# Altium schematic sheet Schematic2_new.SchDoc
size A3; SheetNumber: 1; SheetTotal: 1
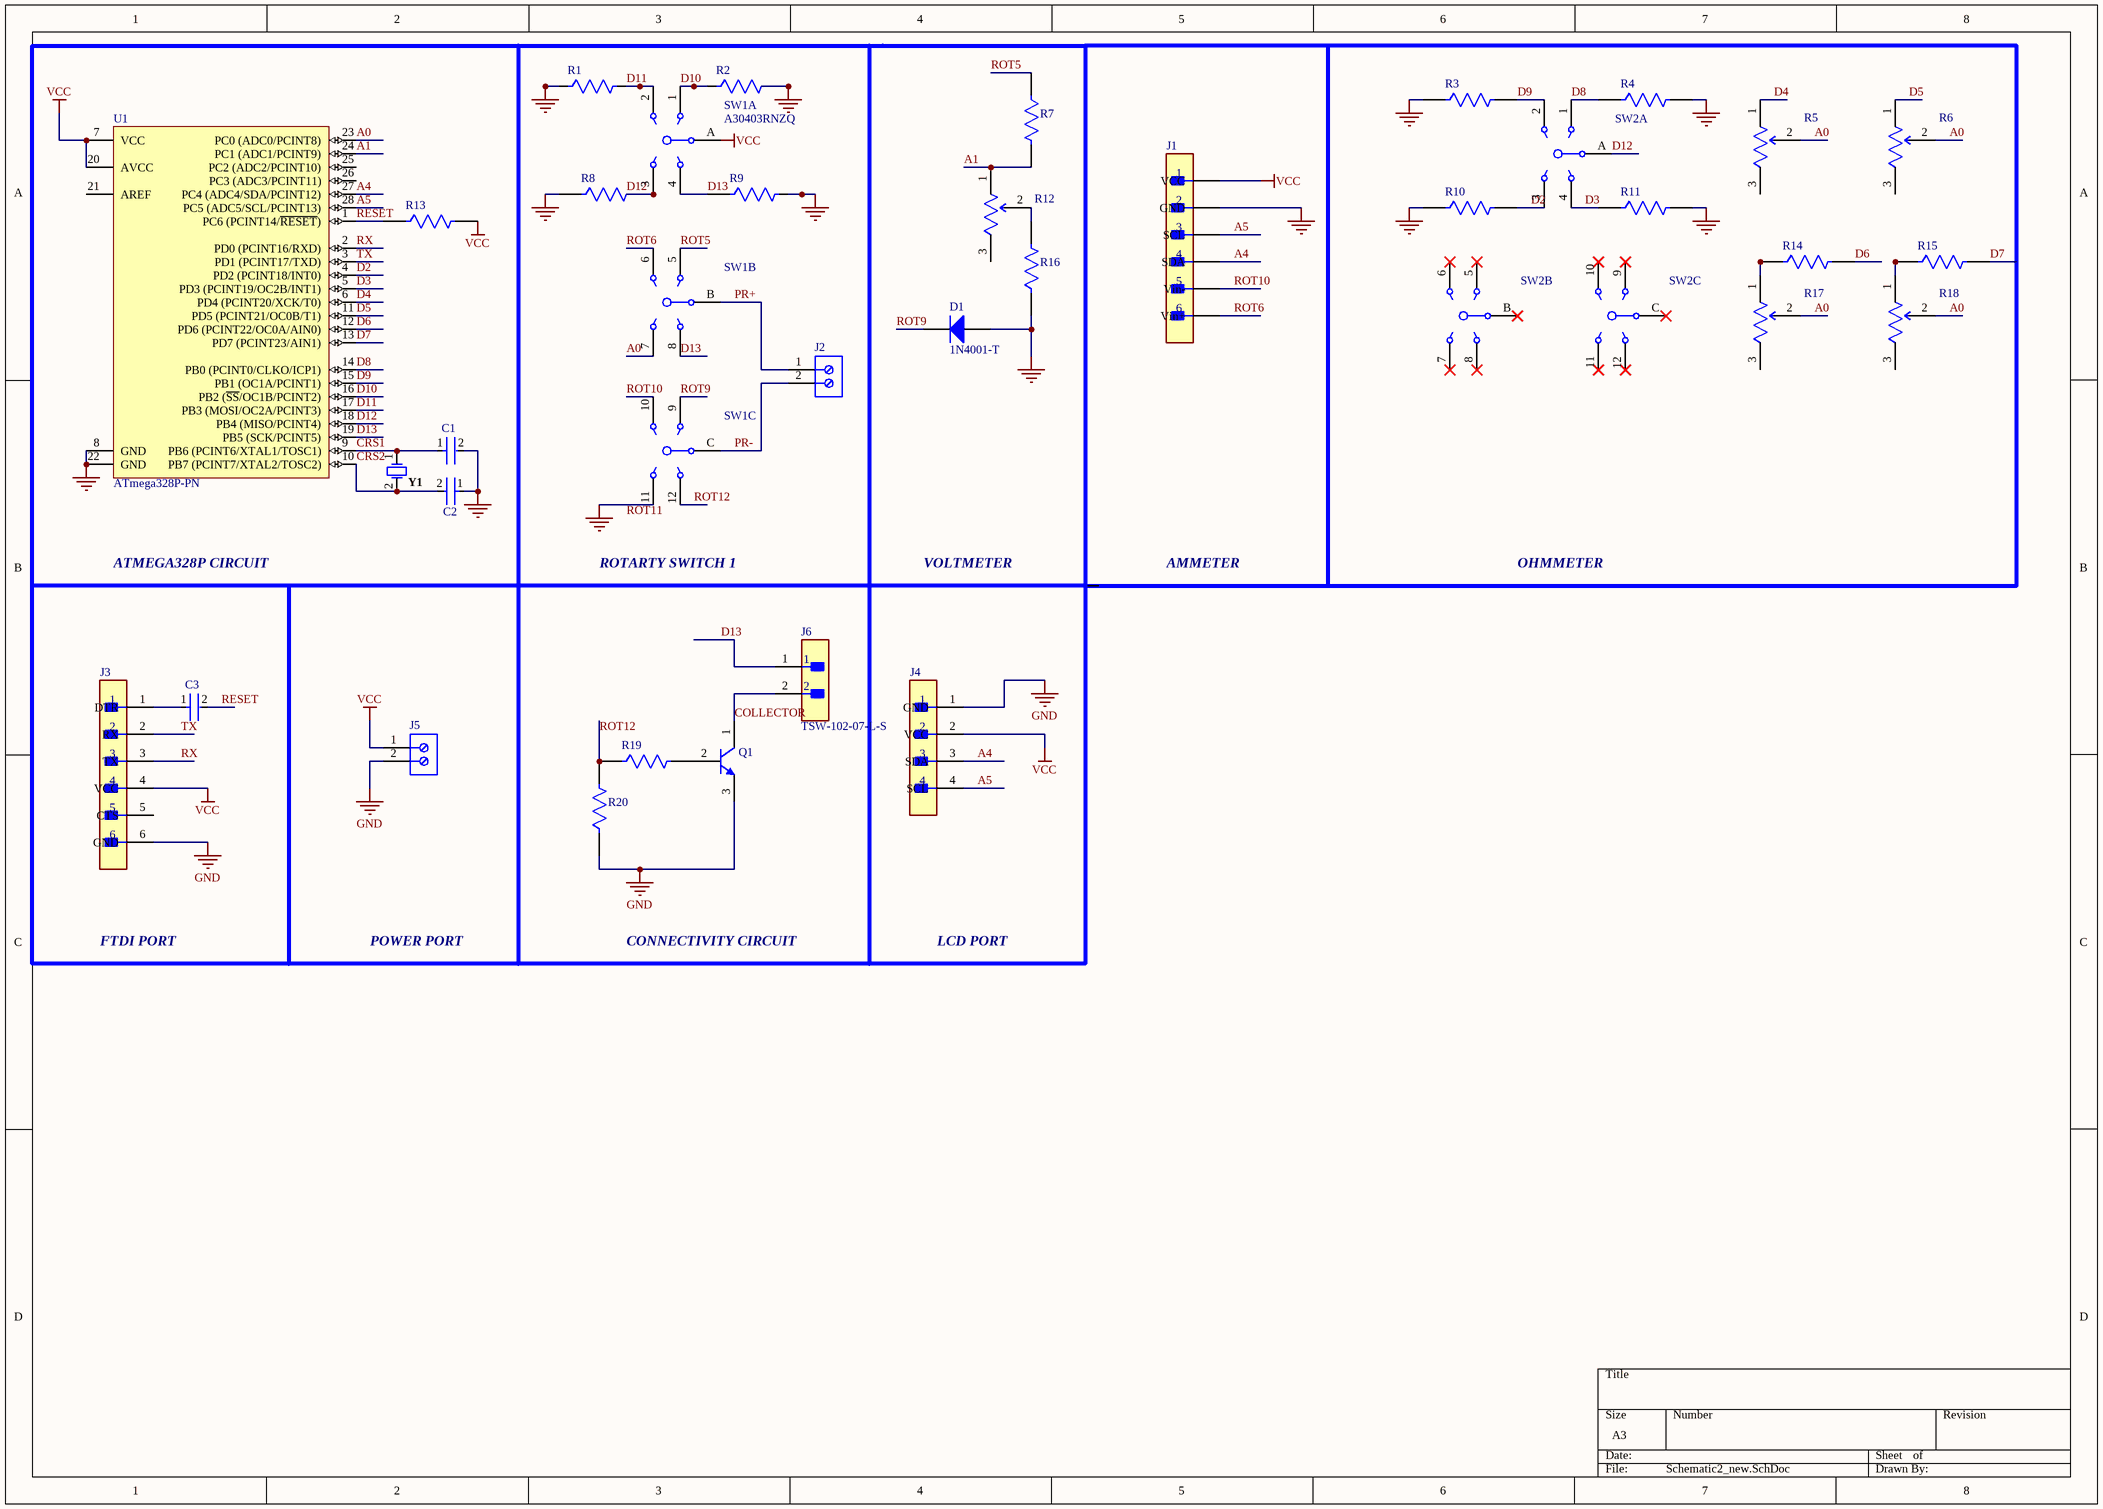
[diagram p0: Schematic2_new.SchDoc]

## Parts
C1  RDE5C1H220J0K1H03B  [FP-RDE0M1-MFG]  (value not drawn)
C2  RDE5C1H220J0K1H03B  [FP-RDE0M1-MFG]  (value not drawn)
C3  RDE5C1H220J0K1H03B  [FP-RDE0M1-MFG]  (value not drawn)
D1  1N4001-T  [DIOD-DO-41-P-2_V]
J1  PEC06SBBN  [FP-PEC06SBBN-MFG]  (value not drawn)
J2  691214110002  [691214110002]  (value not drawn)
J3  PEC06SBBN  [FP-PEC06SBBN-MFG]  (value not drawn)
J4  MTLW-104-05-G-S-185  [FP-MTLW-104-05-G-S-185-MFG]  (value not drawn)
J5  691214110002  [691214110002]  (value not drawn)
J6  TSW-102-07-L-S  [FP-TSW-102-07-L-S-MFG]
Q1  BC547BRL1G  [ONSC-TO-92-3-29-11_AM_BL]  (value not drawn)
R1  G001R1000FE1280  [FP-G001R1000FE1280-MFG]  (value not drawn)
R2  G001R1000FE1280  [FP-G001R1000FE1280-MFG]  (value not drawn)
R3  G001R1000FE1280  [FP-G001R1000FE1280-MFG]  (value not drawn)
R4  G001R1000FE1280  [FP-G001R1000FE1280-MFG]  (value not drawn)
R5  3296W-1-103RLF  [FP-3296W-MFG]  (value not drawn)
R6  3296W-1-103RLF  [FP-3296W-MFG]  (value not drawn)
R7  G001R1000FE1280  [FP-G001R1000FE1280-MFG]  (value not drawn)
R8  G001R1000FE1280  [FP-G001R1000FE1280-MFG]  (value not drawn)
R9  G001R1000FE1280  [FP-G001R1000FE1280-MFG]  (value not drawn)
R10  G001R1000FE1280  [FP-G001R1000FE1280-MFG]  (value not drawn)
R11  G001R1000FE1280  [FP-G001R1000FE1280-MFG]  (value not drawn)
R12  3296W-1-103RLF  [FP-3296W-MFG]  (value not drawn)
R13  G001R1000FE1280  [FP-G001R1000FE1280-MFG]  (value not drawn)
R14  G001R1000FE1280  [FP-G001R1000FE1280-MFG]  (value not drawn)
R15  G001R1000FE1280  [FP-G001R1000FE1280-MFG]  (value not drawn)
R16  G001R1000FE1280  [FP-G001R1000FE1280-MFG]  (value not drawn)
R17  3296W-1-103RLF  [FP-3296W-MFG]  (value not drawn)
R18  3296W-1-103RLF  [FP-3296W-MFG]  (value not drawn)
R19  G001R1000FE1280  [FP-G001R1000FE1280-MFG]  (value not drawn)
R20  G001R1000FE1280  [FP-G001R1000FE1280-MFG]  (value not drawn)
SW1  A30403RNZQ  [CKCP-A30403RNZQ-15_V]  (parts A,B,C of 3)
SW2  A30403RNZQ  [CKCP-A30403RNZQ-15_V]  (value not drawn)  (parts A,B,C of 3)
U1  ATmega328P-PN  [28P3]
Y1  FOXSLF/160-20  [FOX-FOXSLF160-20]  (value not drawn)

## Blocks framed on the sheet
ATMEGA328P CIRCUIT: C1 C2 R13 U1 Y1

## Nets
GND: C1.2 C2.1 D1.1(A) J1.2(GND) J3.6(GND) J4.1(GND) J5.2 Q1.3(E) R1.1 R2.2 R3.1 R4.2 R8.1 R9.2 R10.1 R11.2 R16.1 R20.1 SW1.11 U1.8(GND) U1.22(GND)
VCC: J1.1(VCC) J3.4(VCC) J4.2(VCC) J5.1 R13.2 SW1.A U1.7(VCC) U1.20(AVCC)
A0: R5.2(WIPER) R6.2(WIPER) R17.2(WIPER) R18.2(WIPER) SW1.7 U1.23(PC0_(ADC0/PCINT8))
A1: R7.2 R12.1(CCW) U1.24(PC1_(ADC1/PCINT9))
A4: J1.4(SDA) J4.3(SDA) U1.27(PC4_(ADC4/SDA/PCINT12))
A5: J1.3(SCL) J4.4(SCL) U1.28(PC5_(ADC5/SCL/PCINT13))
COLLECTOR: J6.2 Q1.1(C)
CRS1: C1.1 U1.9(PB6_(PCINT6/XTAL1/TOSC1)) Y1.1
CRS2: C2.2 U1.10(PB7_(PCINT7/XTAL2/TOSC2)) Y1.2
D2: R10.2 SW2.3 U1.4(PD2_(PCINT18/INT0))
D3: R11.1 SW2.4 U1.5(PD3_(PCINT19/OC2B/INT1))
D4: R5.1(CCW) U1.6(PD4_(PCINT20/XCK/T0))
D5: R6.1(CCW) U1.11(PD5_(PCINT21/OC0B/T1))
D6: R14.2 U1.12(PD6_(PCINT22/OC0A/AIN0))
D7: R15.2 U1.13(PD7_(PCINT23/AIN1))
D8: R4.1 SW2.1 U1.14(PB0_(PCINT0/CLKO/ICP1))
D9: R3.2 SW2.2 U1.15(PB1_(OC1A/PCINT1))
D10: R2.1 SW1.1 U1.16(PB2_(~{SS}/OC1B/PCINT2))
D11: R1.2 SW1.2 U1.17(PB3_(MOSI/OC2A/PCINT3))
D12: R8.2 SW1.3 SW2.A U1.18(PB4_(MISO/PCINT4))
D13: J6.1 R9.1 SW1.4 SW1.8 U1.19(PB5_(SCK/PCINT5))
PR+: J2.1 SW1.B
PR-: J2.2 SW1.C
RESET: C3.2 R13.1 U1.1(PC6_(PCINT14/~{RESET}))
ROT5: R7.1 SW1.5
ROT6: J1.6(Vin+) SW1.6
ROT9: D1.2(K) SW1.9
ROT10: J1.5(Vin-) SW1.10
ROT12: R19.1 R20.2 SW1.12
RX: J3.3(TX) U1.2(PD0_(PCINT16/RXD))
TX: J3.2(RX) U1.3(PD1_(PCINT17/TXD))
NetC3_1: C3.1 J3.1(DTR)
NetQ1_2: Q1.2(B) R19.2
NetR12_2: R12.2(WIPER) R16.2
NetR14_1: R14.1 R17.1(CCW)
NetR15_1: R15.1 R18.1(CCW)

Not connected (* = marked no-connect by the designer): J3 5(CTS); R5 3(CW); R6 3(CW); R12 3(CW); R17 3(CW); R18 3(CW); SW2 5* 6* 7* 8* 9* 10* 11* 12* B* C*; U1 21(AREF) 25(PC2_(ADC2/PCINT10)) 26(PC3_(ADC3/PCINT11))

## Notes on the sheet
- ROTARTY SWITCH 1
- VOLTMETER
- AMMETER
- OHMMETER
- FTDI PORT
- POWER PORT
- CONNECTIVITY CIRCUIT
- LCD PORT
- Labels drawn without touching a wire or pin: ROT11

## Library data of the parts
C1-C3 = CMP-06035-055552-1: Ceramic Capacitor 22pF ±5% 50V C0G Radial; Lead Diameter: 0.5mm; Capacitance: 22pF; Width: 0.098inch; Dielectric: C0G; Length: 0.157inch; Max Operating Temperature: 125°C; Case/Package: Radial; Voltage Rating (DC): 50V; Lead Free: Lead Free; Voltage Rating: 50V; Termination: Radial; Mount: Through Hole; Tolerance: 5%; Resistor Type: Ceramic; Packaging: Bulk; Package Quantity: 500; Lead Pitch: 0.197inch; Min Operating Temperature: -55°C; Height - Seated (Max): 0.236inch; Height: 3.5mm
D1 = CMP-0639-00006-2: 1.0 A Rectifier, 15 pF, 50 V, -65 to 150 degC, 2-Pin DO-41 Plastic, RoHS, Tape and Reel; Manufacturer: Diodes Inc; VF (V): 1; CT (pF): 15; Max. IR (uA): 5; VRRM (V): 50; Max. IFSM (A): 30; RoHS: TRUE; Mounting Technology: Through Hole; PartNumber: 1N4001-T; ComponentLink2Description: Datasheet; DatasheetVersion: Rev. 8-2; Operating Temperature Range (degC): -65 to 150; Packing: Tape and Reel; PackageReference: DO-41-P-2; ComponentLink1URL: http://diodes.com/; PackageDescription: 2-Pin Axial Lead, Body 4.635 x 2.36 mm, Lead Spread 25.4 mm; ComponentLink2URL: http://diodes.com/datasheets/ds28002.pdf; Max. Average Rectified Current IO (A): 1; ComponentLink1Description: Manufacturer URL
J1 J3 = CMP-25680-000045-1: CONN HEADER R/A 6POS 2.54MM; Number of Contacts: 6; Gender: Male; Pitch: 0.1inch; Connector Type: Male Pin; Termination: Solder; Mount: Through Hole; Contact Material: Bronze; RoHS Compliant: Yes; Height: 3.56mm; Number of Rows: 1; Housing Color: Black; Width: 2.54mm; Contact Type: Male Pin; Contact Plating: Tin; Number of Positions: 6; Package Quantity: 1; Length: 15.2mm; Contact Mating Length: 0.23inch; Packaging: Bulk; Lead Free: Lead Free; Housing Material: Plastic; Color: Black
J2 J5 = CMP-1502-02464-1: Serie 2141 - 3.50 mm Horizontal Entry Modular with Rising Cage Clamp WR-TBL, 2 pin; Manufacturer: Wurth Elektronik; Pin Number: 2; Pitch: 3.50mm; Datasheet URL: http://katalog.we-online.de/em/datasheet/6912141100xx.pdf; Packaging: Box; Mounting Technology: THT; Package Reference: 691214110002; Manufacturer URL: http://www.we-online.de; Part Number: 691214110002; Publisher: WurthElektronik; Operating Temperature: -40to105degC
J4 = CMP-02766-000562-1: CONN HEADER VERT 4POS 2.54MM; Number of Contacts: 4; Contact Resistance: 15mR; Connector Type: Male Pin; Gender: Male; Contact Material: Brass; Height: 6.4mm; Contact Mating Length: 0.185inch; Length: 29.64mm; Number of Positions: 4; Packaging: Rail/Tube; Mount: Through Hole; Depth: 2.48mm; Number of Rows: 1; Radiation Hardening: No; Housing Material: Polymer; Pitch: 2.54mm; Max Operating Temperature: 105°C; Termination: Solder; Min Operating Temperature: -40°C; Color: Black; Orientation: Straight; Housing Color: Black; Contact Plating: Gold
J6 = CMP-02766-001428-1: CONN HEADER VERT 2POS 2.54MM; Voltage Rating: 550V; Current Rating: 7.6A; Gender: Male; Number of Contacts: 2; Connector Type: Male Pin; Radiation Hardening: No; Orientation: Straight; Contact Plating: Gold; Max Operating Temperature: 125°C; Mount: Through Hole; Package Quantity: 1; Number of Rows: 1; Housing Material: Polyester; RoHS Compliant: Yes; Length: 5.08mm; Max Voltage Rating (AC): 550V; Pitch: 2.54mm; Packaging: Bulk; Depth: 2.54mm; Termination: Solder; Min Operating Temperature: -55°C; Housing Color: Black; Lead Free: Lead Free; Color: Black; Number of Positions: 2; Width: 2.54mm; Max Current Rating: 7.6A; REACH SVHC: No SVHC; Contact Material: Bronze; Contact Mating Length: 0.23inch; Series: TSW; Contact Type: Male Pin
Q1 = CMP-1048-01605-1: Amplifier Transistor, NPN Silicon, 3-Pin TO-92, Pb-Free, Tape and Reel; Manufacturer: On Semiconductor; IC Continuous (A): 0.1; fT Min (MHz): 150; ComponentLink2URL: http://www.onsemi.com/pub_link/Collateral/BC546-D.PDF; ComponentLink1URL: http://www.onsemi.com/; ComponentLink2Description: Datasheet; RoHS: TRUE; ComponentLink3Description: Package Specification; ComponentLink1Description: Manufacturer URL; ComponentLink3URL: http://www.onsemi.com/pub_link/Collateral/MAC97-D.PDF; PackageDescription: 3-Pin Transistor Outline, Body 4.825 x 3.685 mm, Pitch 1.27 mm; Packing: Tape and Reel; PackageVersion: Rev. AM; Polarity: NPN; DatasheetVersion: Rev. 7; Mounting Technology: Through Hole; PackageReference: TO-92-3-29-11_AM_BL; PartNumber: BC547BRL1G
R1-R4 R7-R11 R13-R16 R19 R20 = CMP-02408-000025-1: Res Wirewound 0.1 Ohm 1% 1W ±90ppm/°C Ceramic Hi Temp Sil AXL Thru-Hole Bulk; Resistance: 100mR; Case/Package: Ceramic; Construction: Cylindrical; Diameter: 2.16mm; Series: G; Tolerance: 1%; Max Operating Temperature: 250°C; Lead Free: Lead Free; Resistor Type: Wirewound; Contact Plating: Tin; Mount: Through Hole; Radiation Hardening: No; RoHS Compliant: Yes; Termination: Axial; Temperature Coefficient: 90ppm/°C; Min Operating Temperature: -65°C; Length: 7.14mm; Military Standard: Not; Packaging: Tape and Reel; Power Rating: 1W
R5 = CMP-07234-000024-1: TRIMMER 10K OHM 0.5W PC PIN TOP; Resistance: 1kR; Temperature Coefficient: 100ppm/°C; Power Rating: 500mW; Tolerance: 10%; Number of Turns: 25; Width: 0.19inch; Termination: Pin; Radiation Hardening: No; Contact Plating: Tin; Composition: Cermet; Length: 9.53mm; Height: 0.395inch; Depth: 4.83mm; REACH SVHC: No SVHC; Weight: 0.03oz; Min Operating Temperature: -55°C; Military Standard: Not; Max Operating Temperature: 125°C; Packaging: Tape and Reel; Package Quantity: 1; Taper: Linear; Max Power Dissipation: 500mW; Mount: Through Hole
R6 = CMP-07234-000024-1: TRIMMER 10K OHM 0.5W PC PIN TOP; Resistance: 10kR; Temperature Coefficient: 100ppm/°C; Power Rating: 500mW; Tolerance: 10%; Number of Turns: 25; Width: 0.19inch; Termination: Pin; Radiation Hardening: No; Contact Plating: Tin; Composition: Cermet; Length: 9.53mm; Height: 0.395inch; Depth: 4.83mm; REACH SVHC: No SVHC; Weight: 0.03oz; Min Operating Temperature: -55°C; Military Standard: Not; Max Operating Temperature: 125°C; Packaging: Tape and Reel; Package Quantity: 1; Taper: Linear; Max Power Dissipation: 500mW; Mount: Through Hole
R12 = CMP-07234-000024-1: TRIMMER 10K OHM 0.5W PC PIN TOP; Resistance: 50kR; Temperature Coefficient: 100ppm/°C; Power Rating: 500mW; Tolerance: 10%; Number of Turns: 25; Width: 0.19inch; Termination: Pin; Radiation Hardening: No; Contact Plating: Tin; Composition: Cermet; Length: 9.53mm; Height: 0.395inch; Depth: 4.83mm; REACH SVHC: No SVHC; Weight: 0.03oz; Min Operating Temperature: -55°C; Military Standard: Not; Max Operating Temperature: 125°C; Packaging: Tape and Reel; Package Quantity: 1; Taper: Linear; Max Power Dissipation: 500mW; Mount: Through Hole
R17 = CMP-07234-000024-1: TRIMMER 10K OHM 0.5W PC PIN TOP; Resistance: 20kR; Temperature Coefficient: 100ppm/°C; Power Rating: 500mW; Tolerance: 10%; Number of Turns: 25; Width: 0.19inch; Termination: Pin; Radiation Hardening: No; Contact Plating: Tin; Composition: Cermet; Length: 9.53mm; Height: 0.395inch; Depth: 4.83mm; REACH SVHC: No SVHC; Weight: 0.03oz; Min Operating Temperature: -55°C; Military Standard: Not; Max Operating Temperature: 125°C; Packaging: Tape and Reel; Package Quantity: 1; Taper: Linear; Max Power Dissipation: 500mW; Mount: Through Hole
R18 = CMP-07234-000024-1: TRIMMER 10K OHM 0.5W PC PIN TOP; Resistance: 100KR; Temperature Coefficient: 100ppm/°C; Power Rating: 500mW; Tolerance: 10%; Number of Turns: 25; Width: 0.19inch; Termination: Pin; Radiation Hardening: No; Contact Plating: Tin; Composition: Cermet; Length: 9.53mm; Height: 0.395inch; Depth: 4.83mm; REACH SVHC: No SVHC; Weight: 0.03oz; Min Operating Temperature: -55°C; Military Standard: Not; Max Operating Temperature: 125°C; Packaging: Tape and Reel; Package Quantity: 1; Taper: Linear; Max Power Dissipation: 500mW; Mount: Through Hole
SW1 SW2 = CMP-1076-00008-1: A Series Rotary Switch, 3 Poles, 4 Positions, 30 deg Angle of Throw, -30 to 85 degC, RoHS; Manufacturer: C&K Components; Angle of Throw: 30 deg; Position: 4; Pole: 3; Series: A; Temperature Range: -30 to 85 degC; PackageDescription: 15-Pin Through Hole Device, Dia 26.19 mm, Height 32.02 mm; RoHS: TRUE; ComponentLink1URL: http://www.ck-components.com/; ComponentLink3Description: Package Specification; ComponentLink2Description: Datasheet; PartNumber: A30403RNZQ; DatasheetVersion: 41821; ComponentLink1Description: Manufacturer URL; Mounting Technology: Through Hole; PackageReference: A30403RNZQ-15; ComponentLink2URL: http://www.ck-components.com/13397/arotary_9apr14.pdf/; ComponentLink3URL: http://www.ck-components.com/13397/arotary_9apr14.pdf/
U1 = CMP-0095-00355-1: 8-bit AVR Microcontroller, 32KB Flash, 1KB EEPROM, 2KB SRAM, 28-pin PDIP, Industrial Grade (-40°C to 105°C); PackageVersion: revB, Sep-2001; ComponentLink1Description: Manufacturer URL; ComponentLink1URL: http://www.atmel.com/; ComponentLink2URL: http://www.atmel.com/dyn/resources/prod_documents/8271.pdf; PackageDescription: 28-lead (0.300"/7.62mm Wide) Plastic Dual Inline Package (PDIP); ComponentLink2Description: ATmega48A/48PA/88A/88PA/168A/168PA/328/328P Datasheet; ComponentLink3Description: ATmega48A/48PA/88A/88PA/168A/168PA/328/328P Summary; DatasheetVersion: revD, May-2011; ComponentLink3URL: http://www.atmel.com/dyn/resources/prod_documents/8271S.pdf; PackageReference: 28P3
Y1 = CMP-1749-00003-1: Resistance Weld Thru-Hole Crystal, 16 MHz, -20 to 70 degC, 2-Pin THD, RoHS, Bulk; Voltage Rating: 250 V; Tolerance: 1%; Resistance: 221 kohm; Case\Package: Axial; Power Rating: 250 mW; RoHSCompliant: true; Package Quantity: 200; Packaging: Bulk; Min Operating Temperature: -55 degC; DatasheetVersion: Mar-15; ComponentLink1URL: http://www.foxonline.com/; Max Operating Temperature: 155 degC; PackageReference: FOXSLF160-20; Mount: Through Hole; PackageDescription: 2-Pin Through Hole Device, Body 11.35 x 4.65 mm; ComponentLink1Description: Manufacturer URL; ComponentLink2URL: http://www.foxonline.com/pdfs/hc49slf.pdf; ComponentLink2Description: Datasheet; Length: 0.248 inch